# EAGLE schematic main_board (EAGLE 9.7.0)
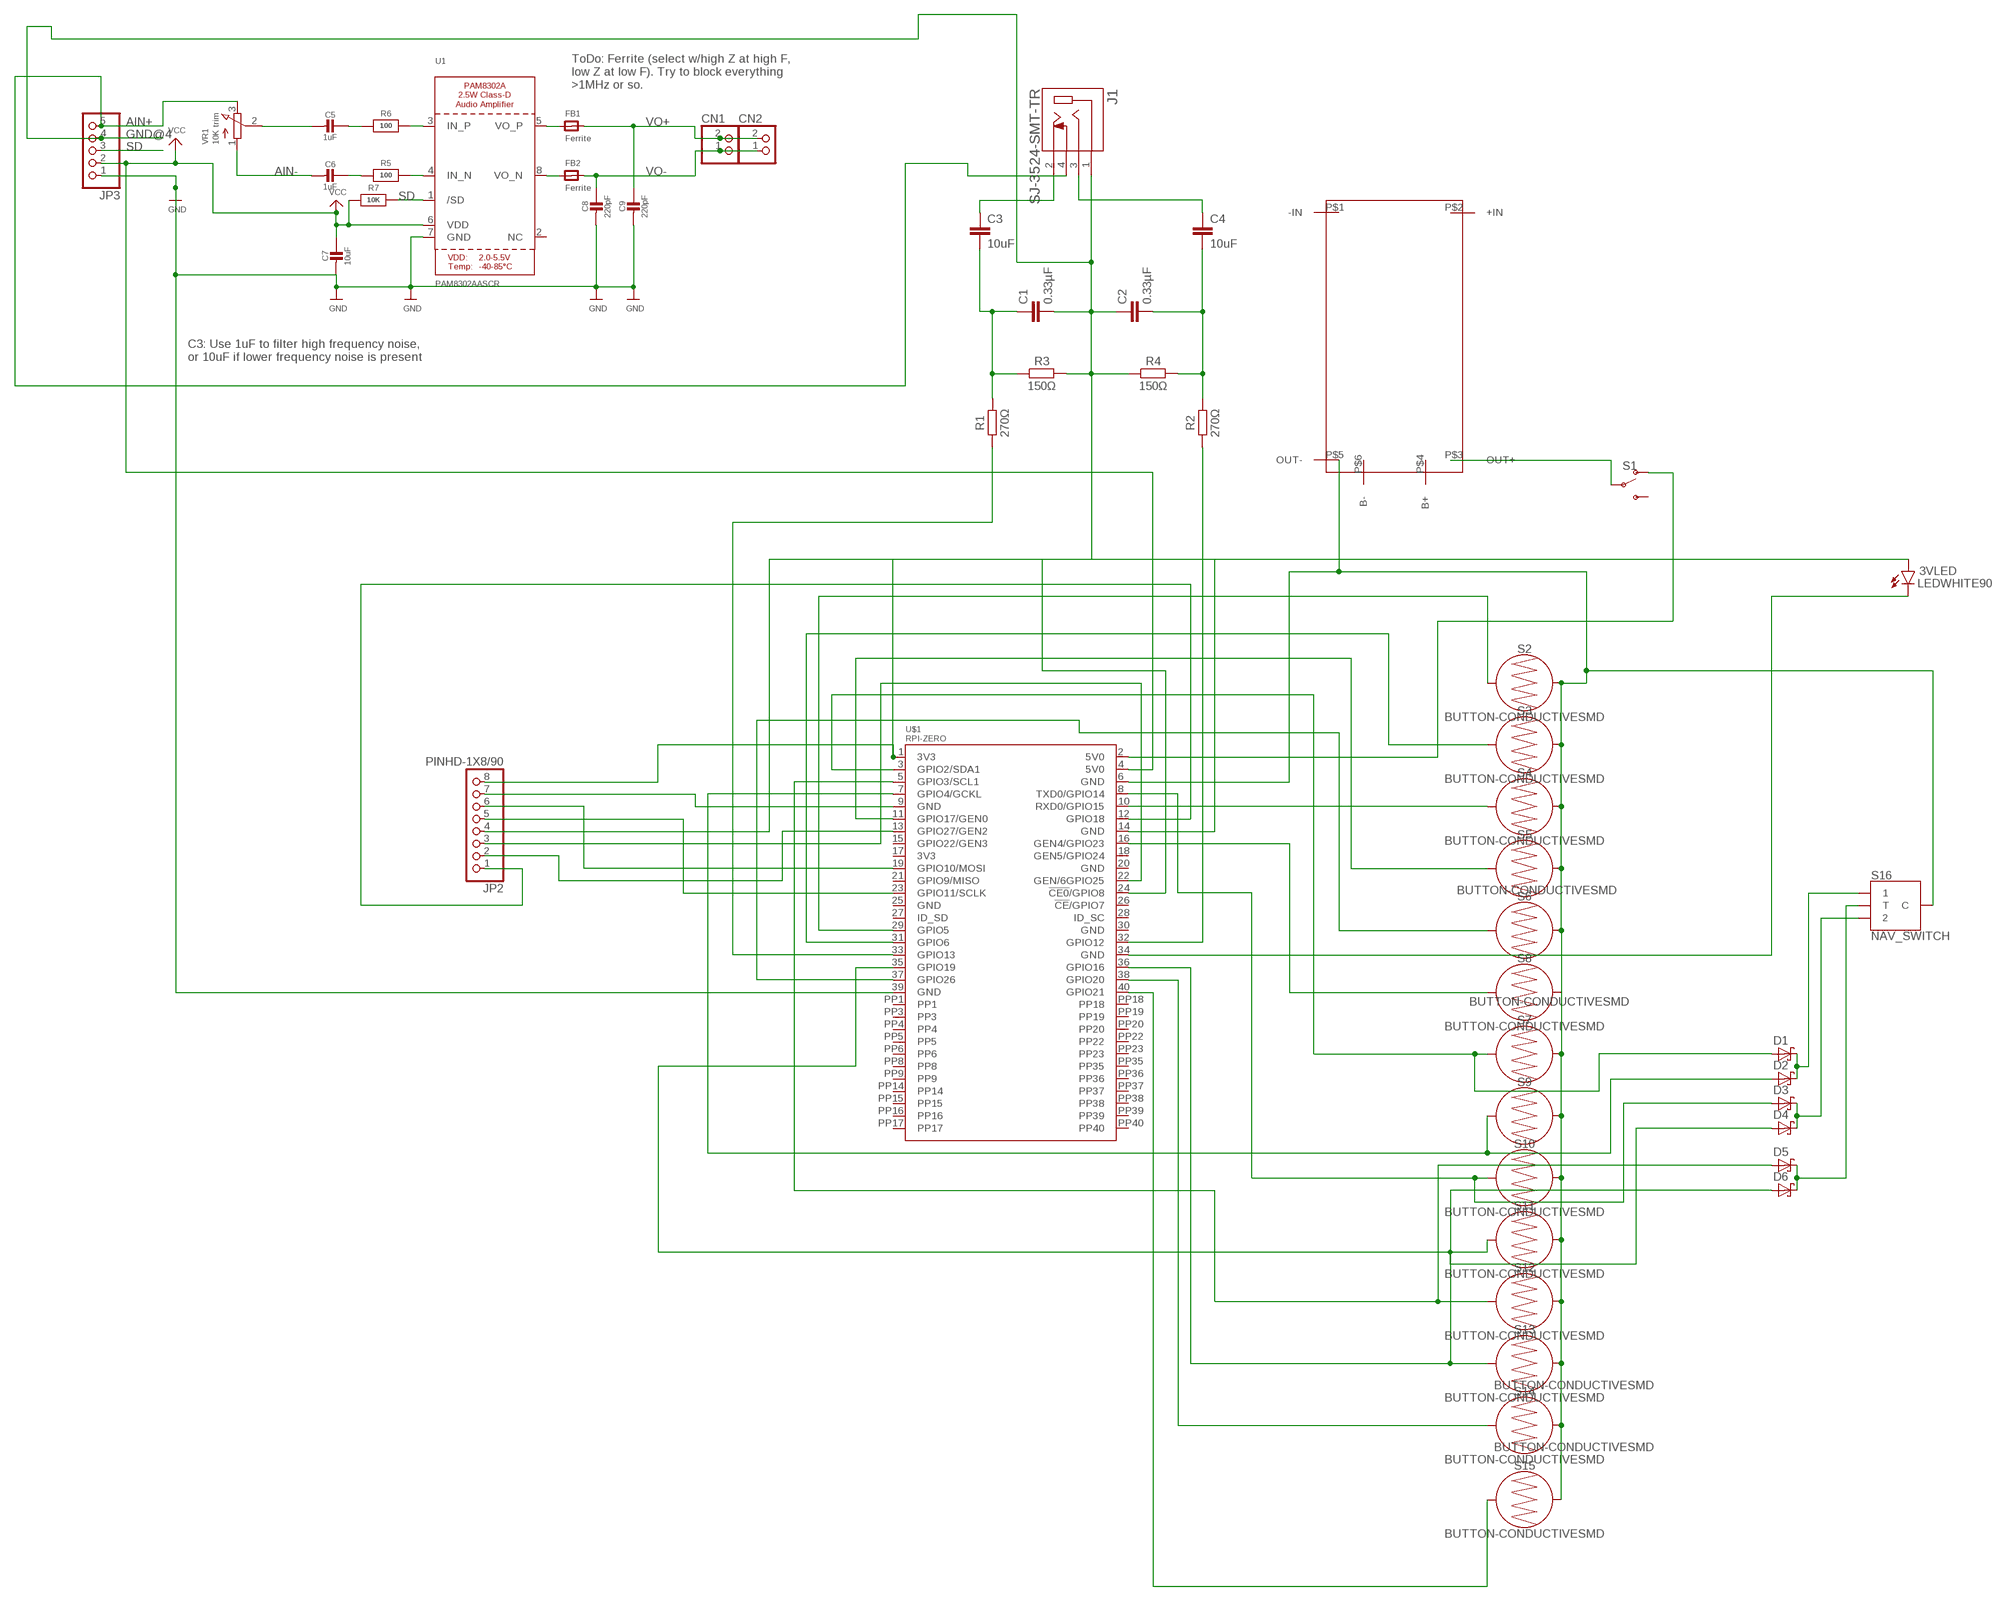
[diagram p0: schematic, sheet 1]

## Parts
3VLED  LEDWHITE90  [LEDRD254W60D565H860B_W90]
C1  0.33µF  0.33UF/330NF-0805-50V-10%  [0805]
C2  0.33µF  0.33UF/330NF-0805-50V-10%  [0805]
C3  10uF  10UF-0402T-6.3V-20%  [0402-TIGHT]
C4  10uF  10UF-0402T-6.3V-20%  [0402-TIGHT]
C5  1uF  CAP_CERAMIC0805-NOOUTLINE  [0805-NO]
C6  1uF  CAP_CERAMIC0805-NOOUTLINE  [0805-NO]
C7  10uF  CAP_CERAMIC0805-NOOUTLINE  [0805-NO]
C8  220pF  CAP_CERAMIC0805-NOOUTLINE  [0805-NO]
C9  220pF  CAP_CERAMIC0805-NOOUTLINE  [0805-NO]
CN1  JST_2PIN-SMT  [JST-PH-2-SMT]
CN2  JST_2PIN-SMT  [JST-PH-2-SMT]
D1  SCHOTTKY-DIODEDO41-7  [DO41-7]
D2  SCHOTTKY-DIODEDO41-7  [DO41-7]
D3  SCHOTTKY-DIODEDO41-7  [DO41-7]
D4  SCHOTTKY-DIODEDO41-7  [DO41-7]
D5  SCHOTTKY-DIODEDO41-7  [DO41-7]
D6  SCHOTTKY-DIODEDO41-7  [DO41-7]
FB1  Ferrite  FERRITE_0805  [_0805]
FB2  Ferrite  FERRITE_0805  [_0805]
J1  SJ-3524-SMT-TR  [SJ-3524-SMT-TR]
JP2  PINHD-1X8/90  [1X08/90]
JP3  HEADER-1X570MIL  [1X05_ROUND_70]
R1  270Ω  RESISTOR_CHIP-1210(3225-METRIC)  [RESC3224X71]
R2  270Ω  RESISTOR_CHIP-1210(3225-METRIC)  [RESC3224X71]
R3  150Ω  RESISTOR_CHIP-1210(3225-METRIC)  [RESC3224X71]
R4  150Ω  RESISTOR_CHIP-1210(3225-METRIC)  [RESC3224X71]
R5  100  RESISTOR0805_NOOUTLINE  [0805-NO]
R6  100  RESISTOR0805_NOOUTLINE  [0805-NO]
R7  10K  RESISTOR0805_NOOUTLINE  [0805-NO]
S1  SWITCH-SPDT-PTH-8.6X4.3MM-LOCK  [SWITCH_SPDT_8.6X4.3MM_LOCK]
S2  BUTTON-CONDUCTIVESMD  [BUTTON-CONDUCTIVE]
S3  BUTTON-CONDUCTIVESMD  [BUTTON-CONDUCTIVE]
S4  BUTTON-CONDUCTIVESMD  [BUTTON-CONDUCTIVE]
S5  BUTTON-CONDUCTIVESMD  [BUTTON-CONDUCTIVE]
S6  BUTTON-CONDUCTIVESMD  [BUTTON-CONDUCTIVE]
S7  BUTTON-CONDUCTIVESMD  [BUTTON-CONDUCTIVE]
S8  BUTTON-CONDUCTIVESMD  [BUTTON-CONDUCTIVE]
S9  BUTTON-CONDUCTIVESMD  [BUTTON-CONDUCTIVE]
S10  BUTTON-CONDUCTIVESMD  [BUTTON-CONDUCTIVE]
S11  BUTTON-CONDUCTIVESMD  [BUTTON-CONDUCTIVE]
S12  BUTTON-CONDUCTIVESMD  [BUTTON-CONDUCTIVE]
S13  BUTTON-CONDUCTIVESMD  [BUTTON-CONDUCTIVE]
S14  BUTTON-CONDUCTIVESMD  [BUTTON-CONDUCTIVE]
S15  BUTTON-CONDUCTIVESMD  [BUTTON-CONDUCTIVE]
S16  NAV_SWITCH  [NAV_SWITCH]
U1  PAM8302AASCR  AUDIOAMP_PAM8302A  [MSOP8_0.65MM]
U$1  RPI-ZERO  [RASP_PI_ZERO_BOARD_FULL]
U$2  EZ5VBATTCONTROL  [POWERTHANG]
VR1  10K trim  TRIMPOT3303W/X  [TRIMPOT_BOURNS_3303W]

## Nets
3V3@1: 3VLED.1(A) JP2.8 U$1.1(3V3)
5V0@1: S1.1(O) U$1.2(5V0)
5V0@2: C7.1 JP3.2 R7.1 U1.6(VDD) U$1.4(5V0) ; supply symbol labelled VCC
AIN+: J1.4 JP3.5 VR1.3(E)
AIN-: C6.2 VR1.1(A)
GND: C7.2 C8.2 C9.2 JP3.1 U1.7(GND) U$1.39(GND)
GND@1: JP2.7 U$1.9(GND)
GND@4: C1.2 C2.1 J1.1 JP3.4 R3.2 R4.1 U$1.14(GND)
GND@7: 3VLED.2(C) U$1.34(GND)
GND@8: S2.2 S3.2 S4.2 S5.2 S6.2 S7.2 S8.2 S9.2 S10.2 S11.2 S12.2 S13.2 S14.2 S15.2 S16.C U$1.6(GND) U$2.P$5(OUT-)
N$1: R5.2 U1.4(IN_N)
N$2: S14.1 U$1.38(GPIO20)
N$3: D6.A S13.1 U$1.36(GPIO16)
N$4: D5.A S12.1 U$1.5(GPIO3/SCL1)
N$5: S15.1 U$1.40(GPIO21)
N$6: D3.A S10.1 U$1.8(TXD0/GPIO14)
N$7: R6.2 U1.3(IN_P)
N$8: S8.1 U$1.16(GEN4/GPIO23)
N$9: D1.A S7.1 U$1.3(GPIO2/SDA1)
N$10: S6.1 U$1.37(GPIO26)
N$11: S5.1 U$1.11(GPIO17/GEN0)
N$12: JP2.3 U$1.22(GEN/6GPIO25)
N$13: S3.1 U$1.31(GPIO6)
N$14: S2.1 U$1.29(GPIO5)
N$15: JP2.1 U$1.12(GPIO18)
N$16: R1.1 U$1.33(GPIO13)
N$17: C1.1 C3.2 R1.2 R3.1
N$18: C3.1 J1.2
N$19: D2.A S9.1 U$1.7(GPIO4/GCKL)
N$20: C2.2 C4.2 R2.2 R4.2
N$21: C4.1 J1.3
N$22: JP2.6 U$1.19(GPIO10/MOSI)
N$23: JP2.5 U$1.23(GPIO11/SCLK)
N$24: JP2.4 U$1.24(!CE0!/GPIO8)
N$25: S4.1 U$1.10(RXD0/GPIO15)
N$26: JP2.2 U$1.13(GPIO27/GEN2)
N$27: R2.1 U$1.32(GPIO12)
N$28: S1.2(P) U$2.P$3(OUT+)
N$29: D4.A S11.1 U$1.35(GPIO19)
N$30: C6.1 R5.1
N$31: FB2.1 U1.8(VO_N)
N$32: FB1.1 U1.5(VO_P)
N$33: C5.1 R6.1
N$34: C5.2 VR1.2(S)
N$35: D1.C D2.C S16.1
N$36: D3.C D4.C S16.2
N$37: D5.C D6.C S16.T
SD: JP3.3 R7.2 U1.1(/SD)
VO+: C9.1 CN1.2 CN2.2 FB1.2
VO-: C8.1 CN1.1 CN2.1 FB2.2
Unconnected: S1.3(S) U1.2(NC) U$1.15(GPIO22/GEN3) U$1.17(3V3) U$1.18(GEN5/GPIO24) U$1.20(GND) U$1.21(GPIO9/MISO) U$1.25(GND) U$1.26(!CE!/GPIO7) U$1.27(ID_SD) U$1.28(ID_SC) U$1.30(GND) U$1.PP1 U$1.PP3 U$1.PP4 U$1.PP5 U$1.PP6 U$1.PP8 U$1.PP9 U$1.PP14 U$1.PP15 U$1.PP16 U$1.PP17 U$1.PP18 U$1.PP19 U$1.PP20 U$1.PP22 U$1.PP23 U$1.PP35 U$1.PP36 U$1.PP37 U$1.PP38 U$1.PP39 U$1.PP40 U$2.P$1(-IN) U$2.P$2(+IN) U$2.P$4(B+) U$2.P$6(B-)

## Notes on the sheet
- ToDo: Ferrite (select w/high Z at high F,
  low Z at low F). Try to block everything
  >1MHz or so.
- C3: Use 1uF to filter high frequency noise,
  or 10uF if lower frequency noise is present

## Library data of the parts
3VLED = LED Flashlight Component Library:LED: Radial LED (Round), 2.54 mm pitch, 5.65 mm body diameter, 8.60 mm body height Radial LED (Round) package with 2.54 mm pitch (lead spacing), 0.60 mm lead width, 0.50 mm lead thickness, 5.65 mm body diameter and 8.60 mm body height
C1 C2 = SparkFun-Capacitors:0.33UF/330NF: 0.33µF/330nF ceramic capacitors A capacitor is a passive two-terminal electrical component used to store electrical energy temporarily in an electric field.; PROD_ID: CAP-08469
C3 C4 = SparkFun-Capacitors:10UF: 10.0µF ceramic capacitors A capacitor is a passive two-terminal electrical component used to store electrical energy temporarily in an electric field.; PROD_ID: CAP-14848
C5-C9 = microbuilder:CAP_CERAMIC: Ceramic Capacitors For new designs, use the packages preceded by an '_' character since they are more reliable: The following footprints should be used on most boards: _0402 - Standard footprint for regular board layouts _0603 - Standard footprint for regular board layouts _0805 - Standard footprint for regular board layouts _1206 - Standard footprint for regular board layouts For extremely tight-pitch boards where space is at a premium, the following 'micro-pitch' footprints can be used (smaller pads, no silkscreen outline, etc.): _0402MP - Micro-pitch footprint for very dense/compact boards _0603MP - Micro-pitch footprint for very dense/compact boards _0805MP - Micro-pitch footprint for very dense/compact boards _1206MP - Micro-pitch footprint for very dense/compact boards
CN1 CN2 = adafruit:JST_2PIN: JST 2-Pin Connectors of various flavors SMT-RA (S2B-PH-SM4) 4UConnector #17311 SMT (B2B-PH-SM4) THM-RA (S2B-PH) THM (B2B-PH)
D1-D6 = adafruit:SCHOTTKY-DIODE: Schottky Diode
FB1 FB2 = microbuilder:FERRITE: Ferrite Bead 0603 MMZ1608B121C - 120 Ohm @ 100MHz, 600mA, 0.15 Ohm DC Resistance - Digikey: 445-2164-1-ND BK1608HW121-T - 120 Ohm, 600mA Ferrite Chip - Digikey: 587-1876-2-ND 0805 HZ0805B272R-10 - 2.7K Ohm @ 100MHz, 200mA, 0.8 Ohm DC Resistance - Digikey: 240-2504-1-ND (see also Murata BLM21BD272SN1L) MMZ2012Y152B - 1.5K Ohm @ 100MHz, 500mA, 0.4 Ohm DC Resistance - Digikey: 445-1560-1-ND - Mainly for high frequency (80-400MHz) MMZ2012R102A - 1K Ohm @ 100MHz, 500mA, 0.3 Ohm DC Resistance - Digikey: 445-1555-2-ND - More general purpose (10-200MHz)
J1 = Audio Connectors:SJ-3524-SMT-TR: CONN JACK STEREO 3.5MM SMD R/A Manufacturer's datasheet <https://www.cuidevices.com/product/resource/sj-352x-smt.pdf>; CREATED_BY: PCBLayout.com; DIGIKEY_PARTNO: CP-3524SJTR-ND; MANUFCATURER: CUI Devices; MPN: SJ-3524-SMT-TR
JP2 = Connector:PINHD-1X8: PIN HEADER; CATEGORY: Headers; DESCRIPTION: Header, Right Angle, 8 Position; MANUFACTURER: Generic; MPN: Generic; OPERATING_TEMPERATURE: Generic; PART_STATUS: Active; PITCH: 0.100" (2.54mm); ROHS_COMPLIANCE: Generic; SERIES: Generic; SUB-CATEGORY: Headers, Male Pins; TYPE: Board to Board or Cable, Unshrouded, Through Hole, Right Angle
JP3 = microbuilder:HEADER-1X5: PIN HEADER
R1-R4 = Tinkercad:RESISTOR: Resistor Fixed - Generic
R5-R7 = microbuilder:RESISTOR: Resistors For new designs, use the packages preceded by an '_' character since they are more reliable: The following footprints should be used on most boards: _0402 - Standard footprint for regular board layouts _0603 - Standard footprint for regular board layouts _0805 - Standard footprint for regular board layouts _1206 - Standard footprint for regular board layouts For extremely tight-pitch boards where space is at a premium, the following 'micro-pitch' footprints can be used (smaller pads, no silkscreen outline, etc.): _0402MP - Micro-pitch footprint for very dense/compact boards _0603MP - Micro-pitch footprint for very dense/compact boards _0805MP - Micro-pitch footprint for very dense/compact boards _1206MP - Micro-pitch footprint for very dense/compact boards
S1 = SparkFun-Switches:SWITCH-SPDT: Single Pole, Double Throw (SPDT) Switch Single-pole, double-throw (SPDT) switch. Variant Overview SMD-AYZ0202 Surface Mount DPDT Switch <https://www.sparkfun.com/products/597> (COM-00597) Used on e.g. LilyPad Arduino USB - ATmega32U4 Board <https://www.sparkfun.com/products/12049> PTH-11.6X4.0MM SPDT Mini Power Switch <https://www.sparkfun.com/products/102> (COM-00102) Used on e.g. SparkFun Simon Says - Through-Hole Soldering Kit <https://www.sparkfun.com/products/10547> (KIT-10547) PTH-11.6X4.0MM-KIT KIT version of SPDT Mini Power Switch - Simplifies soldering by removing tStop of switch pins - only one side can be soldered. PTH-11.6X4.0MM-LOCK LOCK version of SPDT Mini Power Switch - Offset pins hold switch in place for easier soldering. SMD-RIGHT-ANGLE Surface Mount Right Angle Switch <https://www.sparkfun.com/products/10860> (COM-10860) Used on e.g. SparkFun ESP8266 Thing <https://www.sparkfun.com/products/13231>; PROD_ID: SWCH-14746
S2-S15 = SparkFun-Switches:BUTTON-CONDUCTIVE: Conductive Button Used with rubber key pads on the Nordic Key FOB <https://www.sparkfun.com/products/retired/8602>. This one was designed and proven to work with the PolyCase Key FOB enclosures <https://www.sparkfun.com/products/retired/9377>. SparkFun Products Nordic Fob <https://www.sparkfun.com/products/retired/8602> (WRL-08602)
S16 = SparkFun-Switches:NAV_SWITCH: Navigation Switch Three way navigation switch. Commonly used as up/down/select on MP3 players. Schematic element and footprint production proven. SparkFun Products Surface Mount Navigation Switch <https://www.sparkfun.com/products/8184> (COM-08184) Used on SparkFun MP3 Trigger <https://www.sparkfun.com/products/13720>; PROD_ID: SWCH-08301; SF_SKU: COM-08184
U1 = microbuilder:AUDIOAMP_PAM8302A: PAM8302A - 2.5W Class-D Mono Audio Amplifier MSOP8 = PAM8302AASCR
U$1 = pi zero reduced pins:RPI-ZERO
U$2 = hw373v1.1:EZ5VBATTCONTROL
VR1 = microbuilder:TRIMPOT: 3-Pin SMT Trimpots Bourns TC33 (X-2) Series 1K - Digikey: TC33X-102ECT-ND 10K - Digikey: TC33X-2-103E 100K - Digikey: TC33X-104ECT-ND Bourns 3303 (W) Series 3mm 10K Single Turn - Digikey: 3303W-103ETR-ND 3mm 100K Single Turn - Digikey: 3303X-104ETR-ND